# Altium schematic sheet SHEET1.SchDoc
size A; SheetNumber: 1; SheetTotal: 1
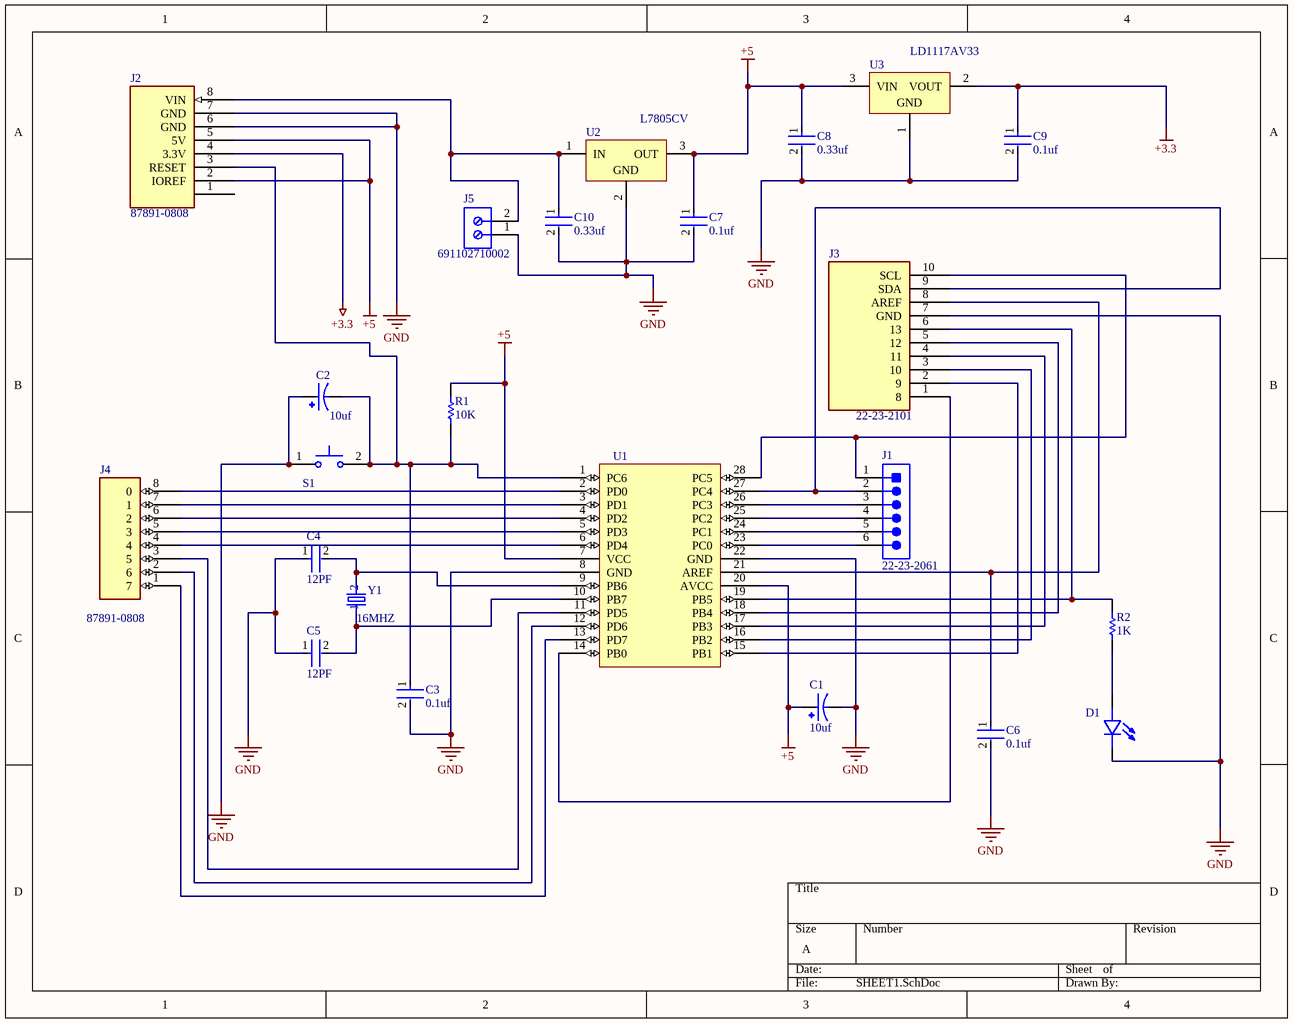
[diagram p0: SHEET1.SchDoc]

## Parts
C1  10uf  [CAPPRD500W50D630H1120]
C2  10uf  [CAPPRD500W50D630H1120]
C3  0.1uf  [FP-K15H5-MFG]
C4  12PF  [FP-K15H5-MFG]
C5  12PF  [FP-K15H5-MFG]
C6  0.1uf  [FP-K15H5-MFG]
C7  0.1uf  [FP-K15H5-MFG]
C8  0.33uf  [FP-K15H5-MFG]
C9  0.1uf  [FP-K15H5-MFG]
C10  0.33uf  [FP-K15H5-MFG]
D1  (no value)  [LED_WP7113LGD]
J1  22-23-2061  [MOLX-22-23-2061_V]
J2  87891-0808  [HDRV8W69P0X254_1X8_2032X251X1641P]
J3  22-23-2101  [SHDR10W87P0X254_1X10_2525X635X1105P]
J4  87891-0808  [HDRV8W69P0X254_1X8_2032X251X1641P]
J5  691102710002  [691102710002]
R1  value 10K  [res]  (hidden comment: Resistor)
R2  value 1K  [res]  (hidden comment: Resistor)
S1  (no value)  [SW_BUTT-2]
U1  (no value)  [DIP787W46P254L3467H508Q28]
U2  L7805CV  [TO220]
U3  LD1117AV33  [TO220]
Y1  16MHZ  [XT9S20ANA16M]

## Nets
+3.3: C9.1 J2.4(3.3V) U3.2(VOUT)
+5: C1.P C7.1 C8.1 J2.2(IOREF) J2.5(5V) R1.2 U1.7(VCC) U1.20(AVCC) U2.3(OUT) U3.3(VIN)
GND: C1.N C2.P C3.2 C4.1 C5.1 C6.2 C7.2 C8.2 C9.2 C10.2 D1.2(C) J2.6(GND) J2.7(GND) J3.7(GND) J5.1 S1.1 U1.8(GND) U1.22(GND) U2.2(GND) U3.1(GND)
NetC2_N: C2.N C3.1 J2.3(RESET) R1.1 S1.2 U1.1(PC6)
NetC4_2: C4.2 U1.9(PB6) Y1.2
NetC5_2: C5.2 U1.10(PB7) Y1.1
NetC6_1: C6.1 J3.8(AREF) U1.21(AREF)
NetC10_1: C10.1 J2.8(VIN) J5.2 U2.1(IN)
NetD1_1: D1.1(A) R2.1
NetJ1_1: J1.1 J3.10(SCL) U1.28(PC5)
NetJ1_2: J1.2 J3.9(SDA) U1.27(PC4)
NetJ1_3: J1.3 U1.26(PC3)
NetJ1_4: J1.4 U1.25(PC2)
NetJ1_5: J1.5 U1.24(PC1)
NetJ1_6: J1.6 U1.23(PC0)
NetJ3_1: J3.1(8) U1.14(PB0)
NetJ3_2: J3.2(9) U1.15(PB1)
NetJ3_3: J3.3(10) U1.16(PB2)
NetJ3_4: J3.4(11) U1.17(PB3)
NetJ3_5: J3.5(12) U1.18(PB4)
NetJ3_6: J3.6(13) R2.2 U1.19(PB5)
NetJ4_1: J4.1(7) U1.13(PD7)
NetJ4_2: J4.2(6) U1.12(PD6)
NetJ4_3: J4.3(5) U1.11(PD5)
NetJ4_4: J4.4 U1.6(PD4)
NetJ4_5: J4.5(3) U1.5(PD3)
NetJ4_6: J4.6(2) U1.4(PD2)
NetJ4_7: J4.7(1) U1.3(PD1)
NetJ4_8: J4.8(0) U1.2(PD0)

Not connected (* = marked no-connect by the designer): J2 1

## Library data of the parts
C1 C2 = EEUFC2A100B: Cap Aluminum Lytic 10uF 100V 20% Radial 105C Automotive Ammo; MF: Panasonic; MP: EEU-FC2A100B; Value: *; Price: None; Package: RADIAL-2 Panasonic; SnapEDA_Link: https://www.snapeda.com/parts/EEU-FC2A100B/Panasonic/view-part/2304901/?ref=snap; Check_prices: https://www.snapeda.com/parts/EEU-FC2A100B/Panasonic/view-part/2304901/?ref=eda; Availability: In Stock; Purchase-URL: https://pricing.snapeda.com/search/part/EEU-FC2A100B/?ref=eda
C3-C10 = CMP-02417-000078-1: CAP CER 0.1UF 50V X7R RADIAL; Capacitance: 100nF; Tolerance: 10%; Dielectric Material: Ceramic; Lead Length: 30mm; Lead Diameter: 0.5mm; Lead/Base Style: Formed Leads; Diameter: 500um; Max Operating Temperature: 125°C; Case/Package: Dipped; Dielectric: X7R; Lead Free: Lead Free; Construction: RADIAL; Voltage: 50V; Thickness: 2.6mm; Min Operating Temperature: -55°C; Lead Pitch: 5mm; Height: 4mm; Radiation Hardening: No; Voltage Rating: 50V; Depth: 2.5mm; Voltage Rating (DC): 50V; Package Quantity: 1; Weight: 0.005644oz; Series: K; Mount: Through Hole; Termination: Radial; Height - Seated (Max): 0.257inch; Length: 4mm; Packaging: Tape and Reel; Width: 2.5mm; RoHS Compliant: Yes
D1 = OVLFY3C7: LED 5mm Round Yellow 30 deg. | Optek (TT Electronics) OVLFY3C7; MF: TT Electronics/Optek Technology; SnapEDA_Link: https://www.snapeda.com/parts/OVLFY3C7/TT+Electronics%252FOptek+Technology/view-part/?ref=snap; Package: Radial Optek; Value: *; MP: OVLFY3C7; Check_prices: https://www.snapeda.com/parts/OVLFY3C7/TT+Electronics%252FOptek+Technology/view-part/?ref=eda
J1 = CMP-2000-05536-1: Male Header, Pitch 2.54 mm, 1 x 6 Position, Height 10.67 mm, Tail Length 3.56 mm, 0 to 70 degC, RoHS, Bulk; Manufacturer: Molex; Pitch: 2.54mm; Mounting Angle: Vertical; Current Rating: 4A; Number of Positions / Contacts: 6; Voltage Rating: 250V; Packaging: Bulk; Package Description: Male Header, Pitch 2.54 mm, 1 x 6 Position, Height 10.67 mm, Tail Length 3.56 mm; Number of Rows: 1; Type: PinStrip; Contact Material: Brass; Product Category: .100K.K.Connectors; Factory Pack Quantity: 1000; Mounting Style: ThroughHole; RoHS: Details; Contact Plating: Tin; Housing Material: Nylon; Mounting Technology: ThroughHole; Termination Style: ThroughHole; Tradename: KK; Number of Positions: 6; Brand: Molex; Product Type: Headers; Series: 6373; Datasheet URL: https://datasheet.ciiva.com/19460/232303-19460895.pdf; Package Reference: 22-23-2061; Datasheet Version: Rev. P, 09/2001; Manufacturer URL: http://www.molex.com/
J2 = 87891-0808: Headers & Wire Housings 2.54MM PITCH SRSW T/H HEADER 8 CKT; Manufacturer_Name: Molex; Geometry.Height: 16.41mm; Manufacturer_Part_Number: 87891-0808; Mouser Part Number: 538-87891-0808; Mouser Price/Stock: https://www.mouser.co.uk/ProductDetail/Molex/87891-0808?qs=iLbezkQI%252Bsh%252BavKMBAJgwA%3D%3D; Arrow Part Number: *; Arrow Price/Stock: *; Datasheet Link: https://www.molex.com/pdm_docs/sd/878910808_sd.pdf
J3 = 22-23-2101: 2.54mm,header,KK,vert,Sn,frictn lock,10w Molex KK 254 Series, Series Number 6373, 2.54mm Pitch 10 Way 1 Row Straight PCB Header, Solder Termination, 4A; Geometry.Height: 11.05mm; Manufacturer_Name: Molex; Manufacturer_Part_Number: 22-23-2101; Mouser Part Number: 538-22-23-2101; Mouser Price/Stock: https://www.mouser.co.uk/ProductDetail/Molex/22-23-2101?qs=ekUqD6al18JrLI5%2F9qV%252BVA%3D%3D; Arrow Part Number: *; Arrow Price/Stock: *; Datasheet Link: http://www.molex.com/pdm_docs/sd/022232101_sd.pdf
J4 = PIN DIGITAL: Headers & Wire Housings 2.54MM PITCH SRSW T/H HEADER 8 CKT; Manufacturer_Name: Molex; Geometry.Height: 16.41mm; Manufacturer_Part_Number: 87891-0808; Mouser Part Number: 538-87891-0808; Mouser Price/Stock: https://www.mouser.co.uk/ProductDetail/Molex/87891-0808?qs=iLbezkQI%252Bsh%252BavKMBAJgwA%3D%3D; Arrow Part Number: *; Arrow Price/Stock: *; Datasheet Link: https://www.molex.com/pdm_docs/sd/878910808_sd.pdf
J5 = CMP-1502-03258-2: NexarPartId: 8917706; Number of Levels: 1; Number of Positions Per Level: 2; Current: 15A; Voltage: 300V; Pitch: 5.0038mm; Plating: Steel; Stripping Length: -6mm; Wire Gauge (Min): 14AWG; Wire Gauge (Max): 22AWG; Length: 7.5mm; Contact Material: Brass; Contact Plating: Tin; Packaging: Box; Number of Pins: 2; Voltage Rating: 300V; Termination: Screw; Number of Contacts: 2; Color: Blue; Current Rating: 15A; Mount: Through Hole; Max Operating Temperature: 105°C; Min Operating Temperature: -40°C; REACH SVHC: Unknown; Height: 13.4mm; Width: 11.2mm; Housing Material: Nylon; RoHS: Compliant; Wire/Cable Gauge: 22AWG; Lead Pitch: 5mm
R1 R2 = Resistor: TC1: 0; SimulationGenericComponent: True; TC2: 0
S1 = BUTT-2: Tactile Switches MINI PUSH BUTTON SWITCH 2-PIN QTY. 4; MF: Gravitech; Purchase-URL: https://pricing.snapeda.com/search/part/BUTT-2/?ref=eda; Package: None; Value: *; Check_prices: https://www.snapeda.com/parts/BUTT-2/Gravitech/view-part/?ref=eda; SnapEDA_Link: https://www.snapeda.com/parts/BUTT-2/Gravitech/view-part/?ref=snap; Availability: In Stock; Price: None; MP: BUTT-2
U1 = atmega328p
U2 = CMP-0244-00483-1: Positive Voltage Regulator, 5V, 3-Pin TO-220; PackageDescription: TO, Thru-Hole, Vertical, Heatsink Mounted; 3 In-Line Leads; Pitch 2.54 mm; ComponentLink2Description: Datasheet; PackageReference: TO220; ComponentLink3URL: http://www.st.com/internet/com/TECHNICAL_RESOURCES/TECHNICAL_LITERATURE/PACKAGE_INFORMATION/CD00004649.pdf; DatasheetVersion: 16/11/2011; ComponentLink1Description: Manufacturer URL; ComponentLink1URL: http://www.st.com; PackageVersion: ver3.0; ComponentLink3Description: Package Specification; ComponentLink2URL: http://www.st.com/internet/com/TECHNICAL_RESOURCES/TECHNICAL_LITERATURE/DATASHEET/CD00000444.pdf
U3 = CMP-0244-00460-1: 1A, Low Drop Positive Voltage Regulator, 3.3V, 3-Pin TO-220; ComponentLink1URL: http://www.st.com; PackageDescription: TO, Thru-Hole, Vertical, Heatsink Mounted; 3 In-Line Leads; Pitch 2.54 mm; PackageVersion: ver3.0; ComponentLink3URL: http://www.st.com/internet/com/TECHNICAL_RESOURCES/TECHNICAL_LITERATURE/PACKAGE_INFORMATION/CD00004649.pdf; ComponentLink3Description: Package Specification; ComponentLink1Description: Manufacturer URL; ComponentLink2URL: http://www.st.com/internet/com/TECHNICAL_RESOURCES/TECHNICAL_LITERATURE/DATASHEET/CD00002116.pdf; PackageReference: TO220; DatasheetVersion: 2/12/2011; ComponentLink2Description: Datasheet
Y1 = XT9S20ANA16M: Microprocessor, Crystal; 16 MHz; + 30 ppm _Typ._ @ 25 degC; 7 pF _Max._; 40 Ohm; MF: Vishay Dale; Value: *; SnapEDA_Link: https://www.snapeda.com/parts/XT9S20ANA16M/Vishay%20Dale/view-part/231144/?ref=snap; Price: None; Availability: Unavailable; Package: None; MP: XT9S20ANA16M